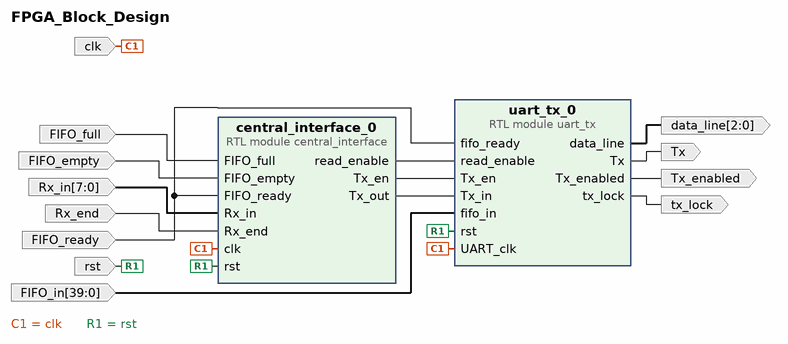
[diagram p0: block diagram of the top level]
# Vivado block design FPGA_Block_Design, xc7a15tcpg236-1, Vivado 2018.2
create_bd_design FPGA_Block_Design

create_bd_port -dir I -from 39 -to 0 FIFO_in
create_bd_port -dir O Tx
create_bd_port -dir O tx_lock
create_bd_port -dir O Tx_enabled
create_bd_port -dir I FIFO_full
create_bd_port -dir I FIFO_ready
create_bd_port -dir I FIFO_empty
create_bd_port -dir I -from 7 -to 0 Rx_in
create_bd_port -dir I Rx_end
create_bd_port -dir I clk
create_bd_port -dir I rst
create_bd_port -dir O -from 2 -to 0 data_line

create_bd_cell -type module -reference central_interface central_interface_0
create_bd_cell -type module -reference uart_tx uart_tx_0

# ---- connections ----

connect_bd_net [get_bd_ports FIFO_full] [get_bd_pins central_interface_0/FIFO_full]
connect_bd_net [get_bd_ports FIFO_ready] [get_bd_pins central_interface_0/FIFO_ready] [get_bd_pins uart_tx_0/fifo_ready]
connect_bd_net [get_bd_ports FIFO_empty] [get_bd_pins central_interface_0/FIFO_empty]
connect_bd_net [get_bd_ports Rx_in] [get_bd_pins central_interface_0/Rx_in]
connect_bd_net [get_bd_ports Rx_end] [get_bd_pins central_interface_0/Rx_end]
connect_bd_net [get_bd_ports clk] [get_bd_pins central_interface_0/clk] [get_bd_pins uart_tx_0/UART_clk]
connect_bd_net [get_bd_ports rst] [get_bd_pins central_interface_0/rst] [get_bd_pins uart_tx_0/rst]
connect_bd_net [get_bd_ports FIFO_in] [get_bd_pins uart_tx_0/fifo_in]
connect_bd_net [get_bd_pins central_interface_0/read_enable] [get_bd_pins uart_tx_0/read_enable]
connect_bd_net [get_bd_pins central_interface_0/Tx_en] [get_bd_pins uart_tx_0/Tx_en]
connect_bd_net [get_bd_pins central_interface_0/Tx_out] [get_bd_pins uart_tx_0/Tx_in]
connect_bd_net [get_bd_pins uart_tx_0/tx_lock] [get_bd_ports tx_lock]
connect_bd_net [get_bd_pins uart_tx_0/Tx_enabled] [get_bd_ports Tx_enabled]
connect_bd_net [get_bd_pins uart_tx_0/Tx] [get_bd_ports Tx]
connect_bd_net [get_bd_pins uart_tx_0/data_line] [get_bd_ports data_line]

validate_bd_design
save_bd_design
